# Altium schematic sheet 2312_Interface.SchDoc
size A3; Author: Miguel Santos; Organization: ETML-ES; Address1: Avenue Recordon 1; Address2: 1004 Lausanne; Address3: Switzerland; SheetNumber: 7; SheetTotal: 7; Version: 1.0
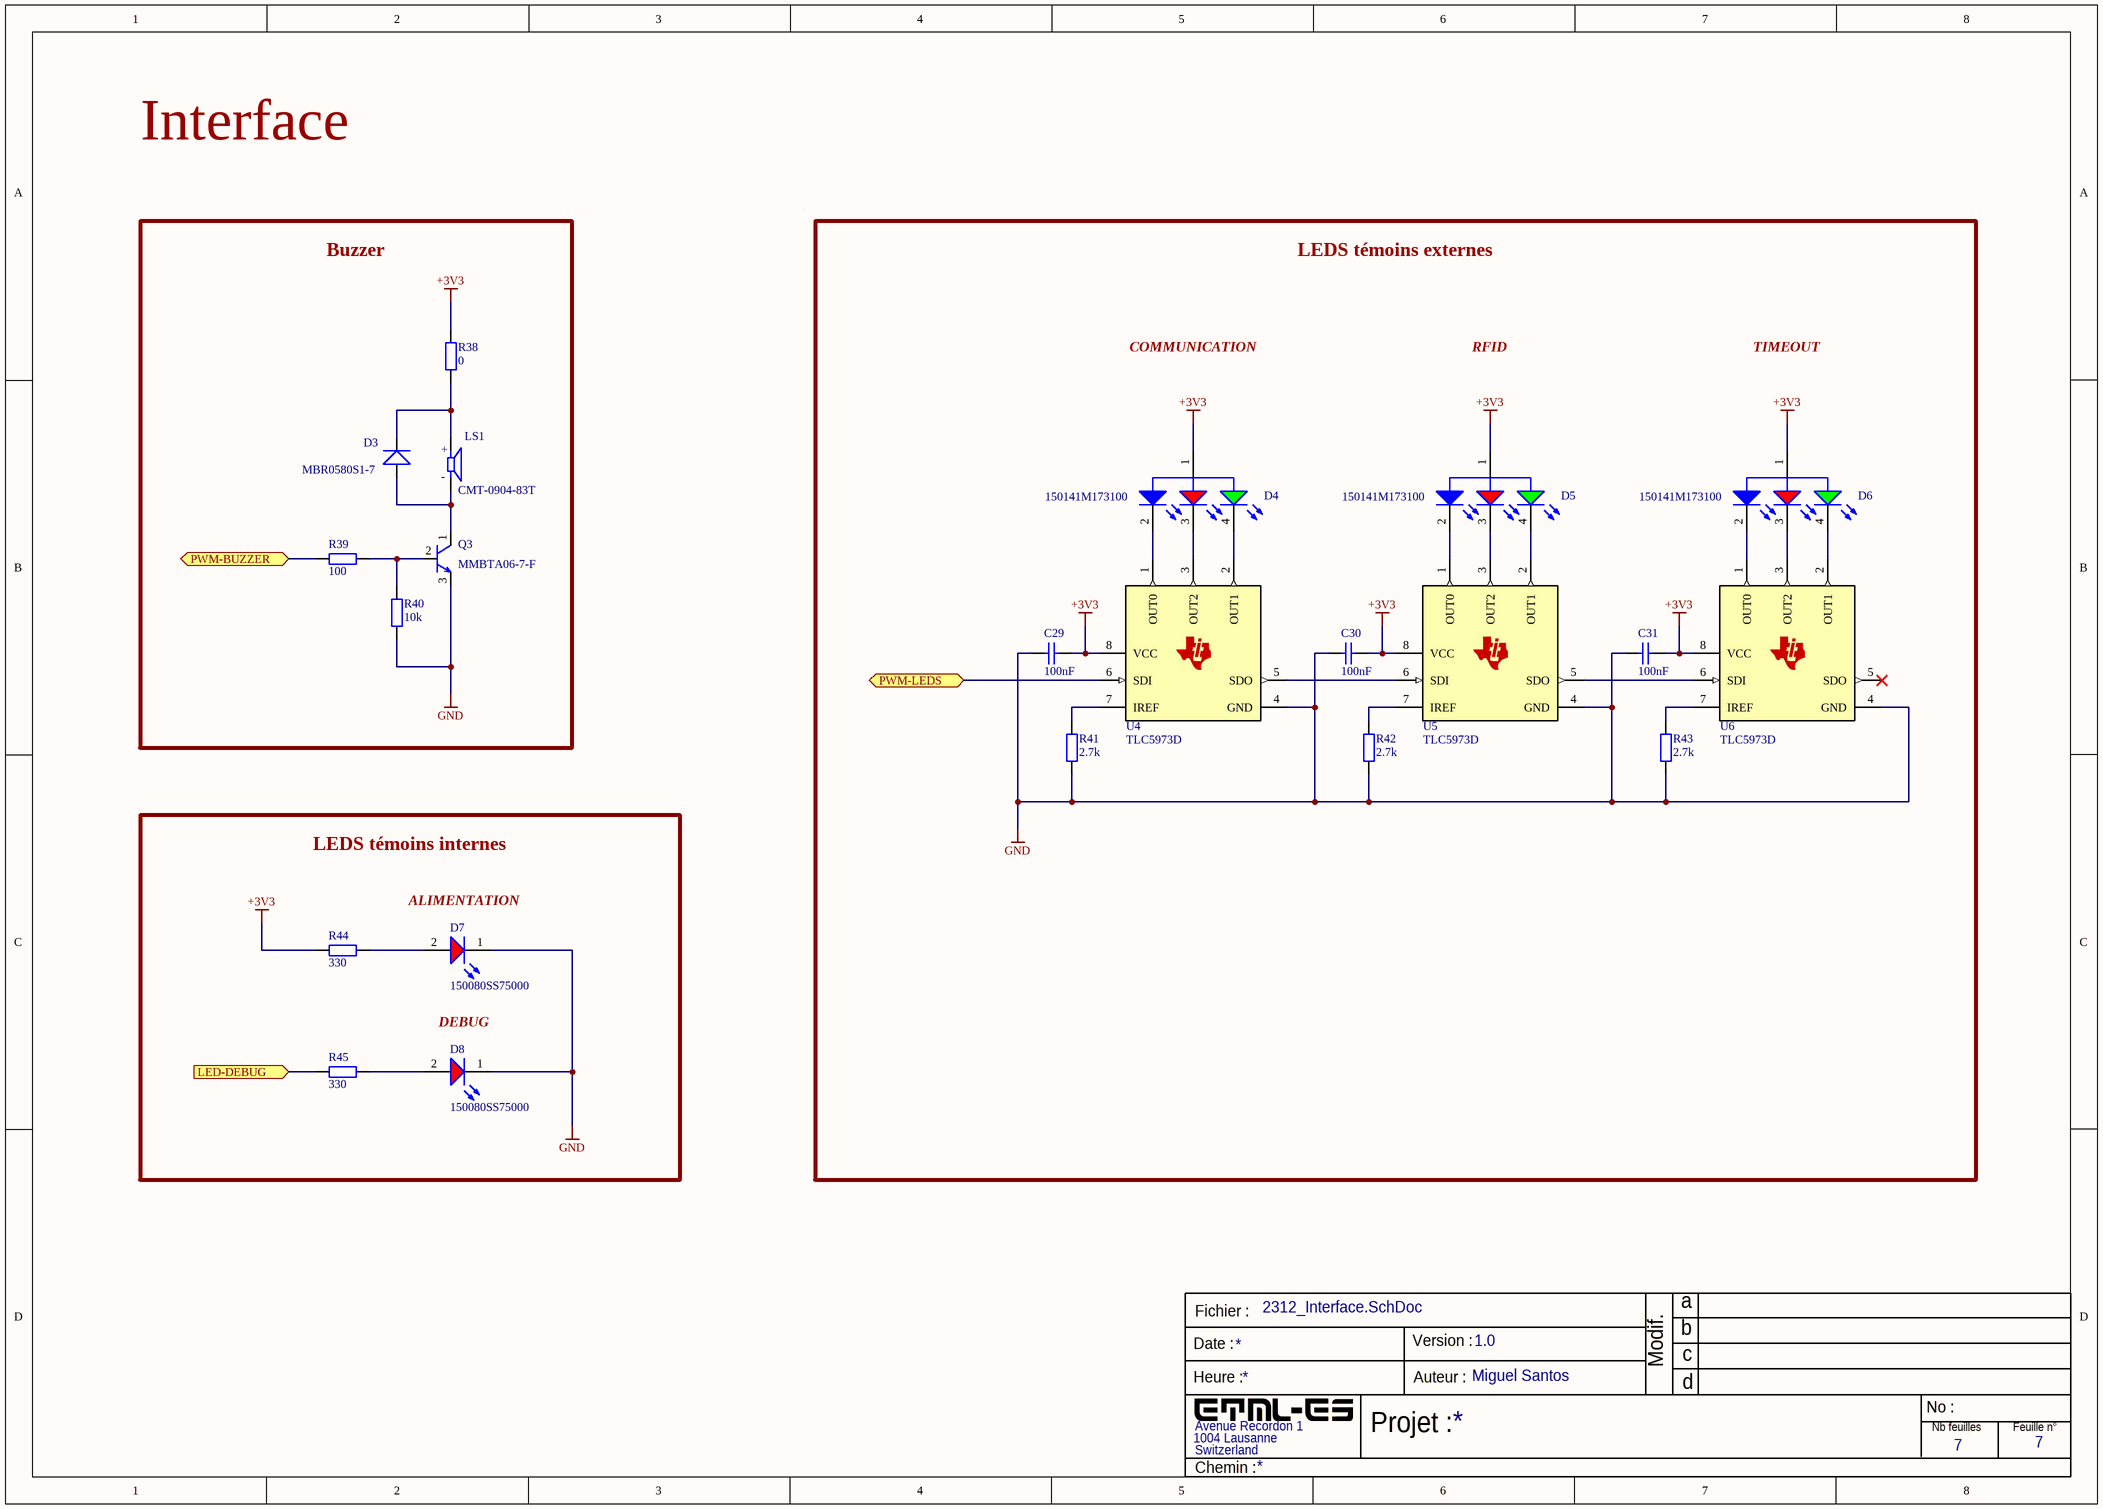
[diagram p0: 2312_Interface.SchDoc]

## Parts
C29  Capacitance: 100nF  [WCAP-CSGP_0805_L2W1.25H0.8_Reflow]  (hidden comment: 885012207016)
C30  Capacitance: 100nF  [WCAP-CSGP_0805_L2W1.25H0.8_Reflow]  (hidden comment: 885012207016)
C31  Capacitance: 100nF  [WCAP-CSGP_0805_L2W1.25H0.8_Reflow]  (hidden comment: 885012207016)
D3  MBR0580S1-7  [MBR0580S1-7_DIO]
D4  150141M173100  [WL-SFTW_3528_150141M173100]
D5  150141M173100  [WL-SFTW_3528_150141M173100]
D6  150141M173100  [WL-SFTW_3528_150141M173100]
D7  150080SS75000  [WL-SMCW_0805_150080xx75000]
D8  150080SS75000  [WL-SMCW_0805_150080xx75000]
LS1  CMT-0904-83T  [XDCR_CMT-0904-83T]
Q3  MMBTA06-7-F  [SOT91P240X120-3N]
R38  Resistance: 0  [2312-RES-0805]  (hidden comment: RES-0805)
R39  Resistance: 100  [2312-RES-0805]  (hidden comment: RES-0805)
R40  Resistance: 10k  [2312-RES-0805]  (hidden comment: RES-0805)
R41  Resistance: 2.7k  [2312-RES-0805]  (hidden comment: RES-0805)
R42  Resistance: 2.7k  [2312-RES-0805]  (hidden comment: RES-0805)
R43  Resistance: 2.7k  [2312-RES-0805]  (hidden comment: RES-0805)
R44  Resistance: 330  [2312-RES-0805]  (hidden comment: RES-0805)
R45  Resistance: 330  [2312-RES-0805]  (hidden comment: RES-0805)
U4  TLC5973D  [D0008A_M]
U5  TLC5973D  [D0008A_M]
U6  TLC5973D  [D0008A_M]

## Blocks framed on the sheet
Buzzer: D3 LS1 Q3 R38-R40
LEDS témoins externes: C29-C31 D4-D6 R41-R43 U4-U6
LEDS témoins internes: D7 D8 R44 R45

## Ports
LED-DEBUG (in), PWM-BUZZER (bidir), PWM-LEDS (bidir)

## Nets
+3V3: C29.2 C30.2 C31.2 D4.1(A) D5.1(A) D6.1(A) R38.2 R44.1 U4.8(VCC) U5.8(VCC) U6.8(VCC)
GND: C29.1 C30.1 C31.1 D7.1(K) D8.1(K) Q3.3(EMITTER) R40.2 R41.1 R42.1 R43.1 U4.4(GND) U5.4(GND) U6.4(GND)
LED-DEBUG: R45.1 ; port LED-DEBUG
PWM-BUZZER: R39.2 ; port PWM-BUZZER
PWM-LEDS: U4.6(SDI) ; port PWM-LEDS
NetD3_1: D3.1 LS1.N Q3.1(COLLECTOR)
NetD3_2: D3.2 LS1.P R38.1
NetD4_2: D4.2(K) U4.1(OUT0)
NetD4_3: D4.3(K) U4.3(OUT2)
NetD4_4: D4.4(K) U4.2(OUT1)
NetD5_2: D5.2(K) U5.1(OUT0)
NetD5_3: D5.3(K) U5.3(OUT2)
NetD5_4: D5.4(K) U5.2(OUT1)
NetD6_2: D6.2(K) U6.1(OUT0)
NetD6_3: D6.3(K) U6.3(OUT2)
NetD6_4: D6.4(K) U6.2(OUT1)
NetD7_2: D7.2(A) R44.2
NetD8_2: D8.2(A) R45.2
NetQ3_2: Q3.2(BASE) R39.1 R40.1
NetR41_2: R41.2 U4.7(IREF)
NetR42_2: R42.2 U5.7(IREF)
NetR43_2: R43.2 U6.7(IREF)
NetU4_5: U4.5(SDO) U5.6(SDI)
NetU5_5: U5.5(SDO) U6.6(SDI)

Not connected (* = marked no-connect by the designer): U6 5(SDO)*

## Notes on the sheet
- Interface
- COMMUNICATION
- RFID
- TIMEOUT
- (near D7) ALIMENTATION
- DEBUG
- Fichier :
- a
- Date :
- Heure :
- Version :
- Auteur :
- Modif.
- b
- c
- d
- Projet :
- No :
- Nb feuilles
- Feuille n°
- Chemin :
- (in symbol CMT-0904-83T) +; -

## Library data of the parts
C29-C31 = 885012207016: WCAP-CSGP Multilayer Ceramic Chip Capacitor, General Purpose, size 0805, X7R, 100nF, 10VDC; Manufacturer: Wurth Elektronik; Case/Size Code: 0805; Capacitance Tolerance: +/-10%; Dissipation Factor: 5%; Insulation Resistance: 5GΩ; Rated Voltage (DC): 10V; Technical Reference: X7R0805104K010DFCT10000; Manufacturer Part Number: 885012207016; Category: Multilayer Ceramic Chip Capacitors; Match Code: WCAP-CSGP; ComponentLink1Description: Website Link; ComponentLink1URL: https://www.we-online.com/redexpert/article/885012207016?ad; ComponentLink2Description: Datasheet Link; ComponentLink2URL: https://www.we-online.com/redexpert/spec/885012207016?ad; Mount: Surface Mount; Operating Temperature Max: 125°C; Operating Temperature Min: -55°C; Packaging: Tape and Reel; Length: 2mm; Width: 1.25mm; Height: 0.8mm; Ceramic Type: X7R
D3 = MBR0580S1-7: Diode Shottky, 500mA, 80V; Mfr_Name: Diodes Inc; Digi-Key_Part_Number_3: MBR0580S1-7DIDKR-ND; Digi-Key_Part_Number_2: MBR0580S1-7DICT-ND; Digi-Key_Part_Number_1: MBR0580S1-7DITR-ND; RefDes: RefDes; Type: Type
D4-D6 = 150141M173100: WL-SFTW Full-color TOP LED Waterclear, size 3528, Red & Green & Blue, 120°; Manufacturer: Wurth Elektronik; Case/Size Code: 3528; Chip Technology: AlInGaP + InGaN; Dominant Wavelength (Blue): 470nm; Dominant Wavelength (Green): 520nm; Dominant Wavelength (Red): 625nm; Forward Voltage (Blue): 3.2V; Forward Voltage (Red): 2V; Luminous Intensity (Blue): 230mcd; Luminous Intensity (Green): 950mcd; Luminous Intensity (Red): 270mcd; Peak Wavelength (Blue): 465nm; Peak Wavelength (Green): 515nm; Peak Wavelength (Red): 635nm; Manufacturer Part Number: 150141M173100; Category: Signal LEDs; Match Code: WL-SFTW; ComponentLink1Description: Website Link; ComponentLink1URL: https://www.we-online.com/redexpert/article/150141M173100?ad; ComponentLink2Description: Datasheet Link; ComponentLink2URL: https://www.we-online.com/redexpert/spec/150141M173100?ad; Mount: Surface Mount; Operating Temperature Max: 85°C; Operating Temperature Min: -40°C; Packaging: Tape and Reel; Length: 3.5mm; Width: 2.8mm; Height: 1.9mm; Emitting Color: Red & Green & Blue; Forward Voltage (Green): 3.2V; Viewing Angle: 120°
D7 D8 = 150080SS75000: WL-SMCW Mono-color Chip LED Waterclear, size 0805, Super Red, 1.9V, 140°; Manufacturer: Wurth Elektronik; Case/Size Code: 0805; Chip Technology: AlInGaP; Dominant Wavelength: 630nm; Luminous Intensity: 60mcd; Peak Wavelength: 645nm; Manufacturer Part Number: 150080SS75000; Category: Signal LEDs; Match Code: WL-SMCW; ComponentLink1Description: Website Link; ComponentLink1URL: https://www.we-online.com/redexpert/article/150080SS75000?ad; ComponentLink2Description: Datasheet Link; ComponentLink2URL: https://www.we-online.com/redexpert/spec/150080SS75000?ad; Mount: Surface Mount; Operating Temperature Max: 85°C; Operating Temperature Min: -40°C; Packaging: Tape and Reel; Length: 2mm; Width: 1.25mm; Height: 0.7mm; Emitting Color: Super Red; Forward Voltage: 1.9V; Viewing Angle: 140°
LS1 = CMT-0904-83T: Buzzer Magnetic, 15Ω; Price: None; Value: *; Package: None; Availability: Unavailable; MP: CMT-0904-83T
Q3 = MMBTA06LT3G: Bipolar (BJT) Transistor NPN 80V 500mA 100MHz 225mW Surface Mount SOT-23-3 (TO-236)
R38 = RES-0805: SMD Resistor 0805, 0Ω
R39 = RES-0805: SMD Resistor 0805, 140Ω
R40 = RES-0805: SMD Resistor 0805, 10kΩ
R41-R43 = RES-0805: SMD Resistor 0805, 2.6kΩ
R44 R45 = RES-0805: SMD Resistor 0805, 330Ω
U4-U6 = TLC5973D: No Description Available; Mfr_Name: Texas Instruments; TYPE: TYPE; RefDes: RefDes